# Altium schematic sheet Clock Buffer.SchDoc
size 297 x 209 mm; CompanyName: Sainsbury Wellcome Centre; Organization: FabLab; Address1: Sainsbury Wellcome Centre; Address2: 25 Howland Street; Address3: London; Address4: W1T 4JG; DocumentNumber: 13; SheetNumber: 13; SheetTotal: 14; swcgroup: FabLab; Org: Sainsbury Wellcome Centre; Add1: 25 Howland Street; Add2: London; Add3: W1T 4JG; WebAddress: www.sainsburywellcome.org; SheetSize: A4; SheetName: Clock Buffer
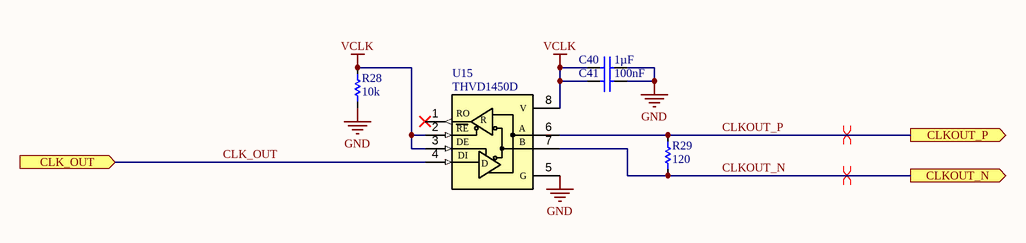
[diagram p0: Clock Buffer.SchDoc]

## Parts
C40  value 1µF  [CAP_CHIP_0603]  (hidden comment: C0603-1uF-50V)
C41  value 100nF  [CAP_CHIP_0603]  (hidden comment: C0603-100nF-50V)
R28  value 10k  [RES_CHIP_0603]  (hidden comment: R0603-10K)
R29  value 120  [RES_CHIP_0603]  (hidden comment: R0603-120R)
U15  THVD1450D  [VSSOP8_3X3_0.65E]

## Ports
CLK_OUT (in), CLKOUT_N (out), CLKOUT_P (out)

## Nets
GND: C40.1 C41.1 R28.1 U15.5(G)
VCLK: C40.2 C41.2 R28.2 U15.2(~{RE}) U15.3(DE) U15.8(V)
CLK_OUT: U15.4(D) ; port CLK_OUT
CLKOUT_N: R29.1 U15.7(B) ; port CLKOUT_N
CLKOUT_P: R29.2 U15.6(A) ; port CLKOUT_P

Not connected (* = marked no-connect by the designer): U15 1(RO)*

## Layout directives
differential pair; differential pair class RS485: CLKOUT_N, CLKOUT_P

## Notes on the sheet
- FILE
- VARIANT
- DATE
- REVISION
- SHEET
- /
- PROJECT
- SIZE
- (in symbol CMP-930-0015-1) R; RE; DI

## Library data of the parts
C40 = CMP-611-0033-11: 0603 Multilayer Ceramic Capacitors MLCC; PartNumber: CL10A105KB8NNNC; Pick&PlaceFootprint: C0603; Voltage Rating: 50V; Dielectric: X5R; Tolerance: 10%; Case/Package: 0603; LCSC Part N.: C15849; RoHS: Yes; Mount: SMD; Capacitor Type: Ceramic
C41 = CMP-611-0027-24: 0603 Multilayer Ceramic Capacitors MLCC; PartNumber: CC0603KRX7R9BB104; Tolerance: 10%; Pick&PlaceFootprint: C0603; Dielectric: X7R; Voltage Rating: 50V; Capacitor Type: Ceramic; RoHS: Yes; Mount: SMD; LCSC Part N.: C14663; Case/Package: 0603
R28 = CMP-633-0002-26: 100mW Thick Film Resistors 75V ±100ppm/℃ ±1% 0603 Chip Resistor; PartNumber: 0603WAF1002T5E; Number of Resistors: 1; Pick&PlaceFootprint: R0603; Case/Package: 0603; Voltage Rating: 75V; Power Rating: 100mW; LCSC Part N.: C25804; Tolerance: 1%; Mount: Surface Mount
R29 = CMP-633-0100-12: 100mW Thick Film Resistors 75V ±100ppm/℃ ±1% 0603 Chip Resistor; PartNumber: 0603WAF1200T5E; Pick&PlaceFootprint: R0603; Number of Resistors: 1; Mount: Surface Mount; Tolerance: 1%; Voltage Rating: 75V; Case/Package: 0603; Power Rating: 100mW; LCSC Part N.: C22787
U15 = CMP-930-0015-1: 3.3-V to 5-V RS-485 transceiver with ±18-kV IEC ESD protection 8-VSSOP -40 to 125; PartNumber: THVD1450DGKR; Simplex/Duplex: Half Duplex; Data Rate: 50Mbps; Max Supply Voltage: 5V; Min Supply Voltage: 3.3V; LCSC Part N.: C2860896